# Altium schematic sheet Headers.SchDoc
size A; SheetNumber: 5; SheetTotal: 5
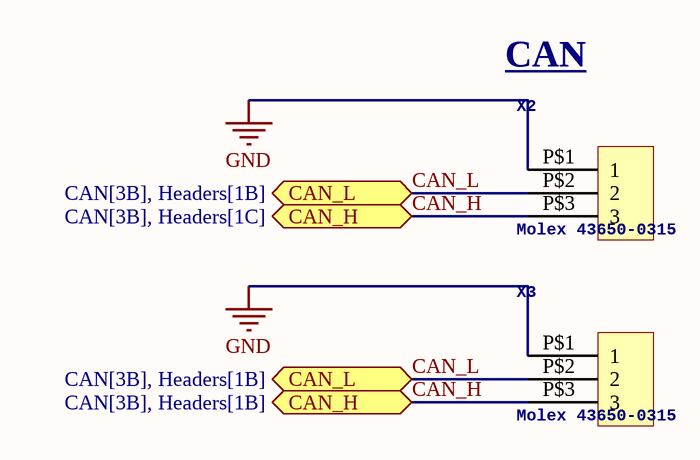
[diagram p0: Headers.SchDoc]

## Parts
X2  Molex 43650-0315  [43650-0315]
X3  Molex 43650-0315  [43650-0315]

## Ports
CAN_H (bidir, see CAN[3B], Headers[1B]), CAN_H (bidir, see CAN[3B], Headers[1C]), CAN_L (bidir, see CAN[3B], Headers[1B])

## Nets
GND: X2.P$1(1) X3.P$1(1)
CAN_H: X2.P$3(3) X3.P$3(3) ; port CAN_H
CAN_L: X2.P$2(2) X3.P$2(2) ; port CAN_L

## Notes on the sheet
- CAN

## Library data of the parts
X2 X3 = Micro-Fit Molex 3 Pin Vertical: GateName_1: G$1; SymbolName_1: HEADER_POS3; DeviceSetName: HEADER_POS3_?; DeviceName: 43650-0315; LibraryName: con-molex-micro-fit-3_0_2; Package: 43650-0315